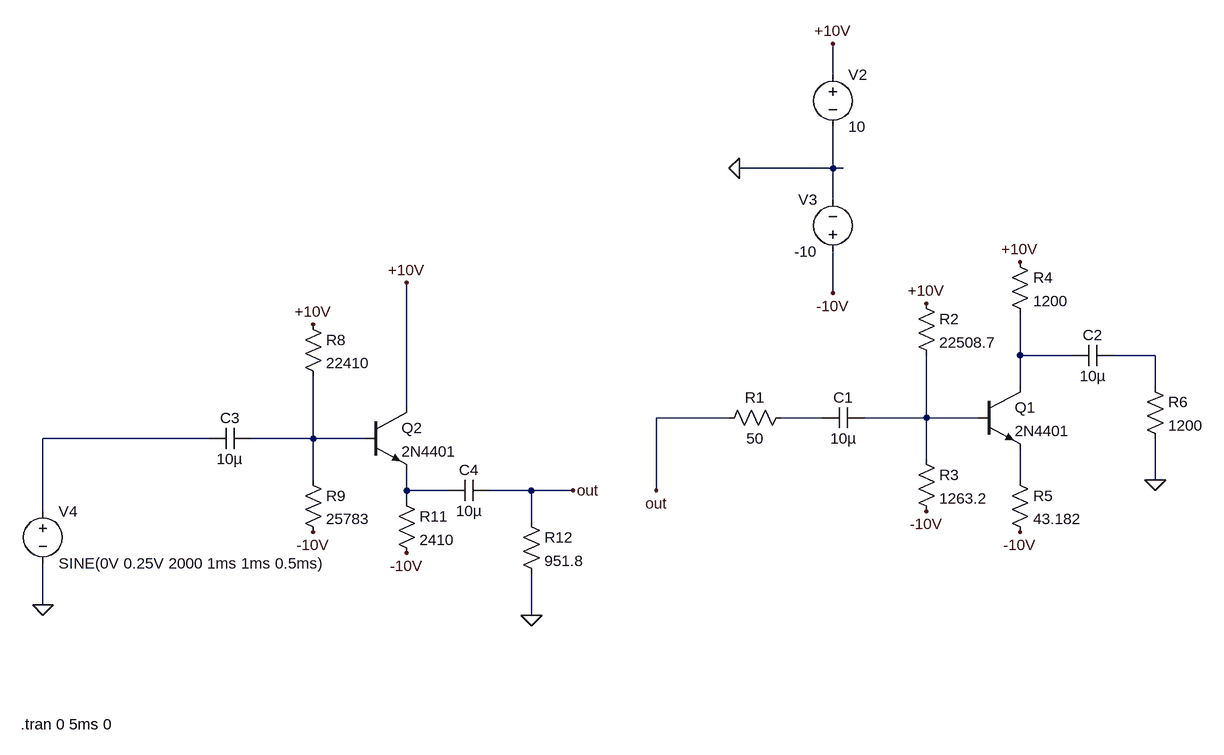
[diagram p0: schematic lab2.asc]
lab2.asc, the LTspice schematic file:
Version 4
SHEET 1 880 680
WIRE 272 -496 272 -544
WIRE 272 -352 272 -416
WIRE 272 -352 128 -352
WIRE 288 -352 272 -352
WIRE 272 -304 272 -352
WIRE 272 -160 272 -224
WIRE 560 -64 560 -128
WIRE 640 -64 560 -64
WIRE 768 -64 704 -64
WIRE 560 -16 560 -64
WIRE 768 -16 768 -64
WIRE -384 16 -384 -176
WIRE 112 32 0 32
WIRE 256 32 192 32
WIRE 416 32 416 -64
WIRE 416 32 320 32
WIRE 496 32 416 32
WIRE -688 64 -944 64
WIRE -528 64 -528 -32
WIRE -528 64 -624 64
WIRE -448 64 -528 64
WIRE 416 96 416 32
WIRE -528 128 -528 64
WIRE 560 128 560 80
WIRE 768 128 768 64
WIRE -384 144 -384 112
WIRE -320 144 -384 144
WIRE -192 144 -256 144
WIRE -128 144 -192 144
WIRE 0 144 0 32
WIRE -384 160 -384 144
WIRE -944 176 -944 64
WIRE -192 192 -192 144
WIRE -944 320 -944 256
WIRE -192 336 -192 272
FLAG 768 128 0
FLAG 128 -352 0
FLAG 272 -544 +10V
FLAG 416 -144 +10V
FLAG 560 -208 +10V
FLAG 272 -160 -10V
FLAG 416 176 -10V
FLAG 560 208 -10V
FLAG -944 320 0
FLAG -192 336 0
FLAG -528 -112 +10V
FLAG -384 -176 +10V
FLAG -528 208 -10V
FLAG -384 240 -10V
FLAG -128 144 out
FLAG 0 144 out
SYMBOL res 208 16 R90
WINDOW 0 0 56 VBottom 2
WINDOW 3 32 56 VTop 2
SYMATTR InstName R1
SYMATTR Value 50
SYMBOL cap 320 16 R90
WINDOW 0 0 32 VBottom 2
WINDOW 3 32 32 VTop 2
SYMATTR InstName C1
SYMATTR Value 10µ
SYMBOL res 400 -160 R0
SYMATTR InstName R2
SYMATTR Value 22508.7
SYMBOL res 400 80 R0
SYMATTR InstName R3
SYMATTR Value 1263.2
SYMBOL npn 496 -16 R0
SYMATTR InstName Q1
SYMATTR Value 2N4401
SYMBOL res 544 -224 R0
SYMATTR InstName R4
SYMATTR Value 1200
SYMBOL res 544 112 R0
SYMATTR InstName R5
SYMATTR Value 43.182
SYMBOL cap 704 -80 R90
WINDOW 0 0 32 VBottom 2
WINDOW 3 32 32 VTop 2
SYMATTR InstName C2
SYMATTR Value 10µ
SYMBOL res 752 -32 R0
SYMATTR InstName R6
SYMATTR Value 1200
SYMBOL voltage 272 -512 R0
WINDOW 123 0 0 Left 0
WINDOW 39 0 0 Left 0
SYMATTR InstName V2
SYMATTR Value 10
SYMBOL voltage 272 -208 R180
WINDOW 0 24 96 Left 2
WINDOW 3 24 16 Left 2
WINDOW 123 0 0 Left 0
WINDOW 39 0 0 Left 0
SYMATTR InstName V3
SYMATTR Value -10
SYMBOL voltage -944 160 R0
WINDOW 123 0 0 Left 0
WINDOW 39 0 0 Left 0
SYMATTR InstName V4
SYMATTR Value SINE(0V 0.25V 2000 1ms 1ms 0.5ms)
SYMBOL cap -624 48 R90
WINDOW 0 0 32 VBottom 2
WINDOW 3 32 32 VTop 2
SYMATTR InstName C3
SYMATTR Value 10µ
SYMBOL res -544 -128 R0
SYMATTR InstName R8
SYMATTR Value 22410
SYMBOL res -544 112 R0
SYMATTR InstName R9
SYMATTR Value 25783
SYMBOL npn -448 16 R0
SYMATTR InstName Q2
SYMATTR Value 2N4401
SYMBOL res -400 144 R0
SYMATTR InstName R11
SYMATTR Value 2410
SYMBOL cap -256 128 R90
WINDOW 0 0 32 VBottom 2
WINDOW 3 32 32 VTop 2
SYMATTR InstName C4
SYMATTR Value 10µ
SYMBOL res -208 176 R0
SYMATTR InstName R12
SYMATTR Value 951.8
TEXT -978 504 Left 2 !.tran 0 5ms 0

The netlist it stands for:
* lab2.asc
R1 N003 out 50
C1 N004 N003 10µ
R2 +10V N004 22508.7
R3 N004 -10V 1263.2
Q1 N001 N004 N007 0 2N4401
R4 +10V N001 1200
R5 N007 -10V 43.182
C2 N002 N001 10µ
R6 N002 0 1200
V2 +10V 0 10
V3 -10V 0 -10
V4 N005 0 SINE(0V 0.25V 2000 1ms 1ms 0.5ms)
C3 N006 N005 10µ
R8 +10V N006 22410
R9 N006 -10V 25783
Q2 +10V N006 N008 0 2N4401
R11 N008 -10V 2410
C4 out N008 10µ
R12 out 0 951.8
.model NPN NPN
.model PNP PNP
.lib standard.bjt
.tran 0 5ms 0
.backanno
.end